# Altium schematic sheet IgnitionSchem2.SchDoc
size A4
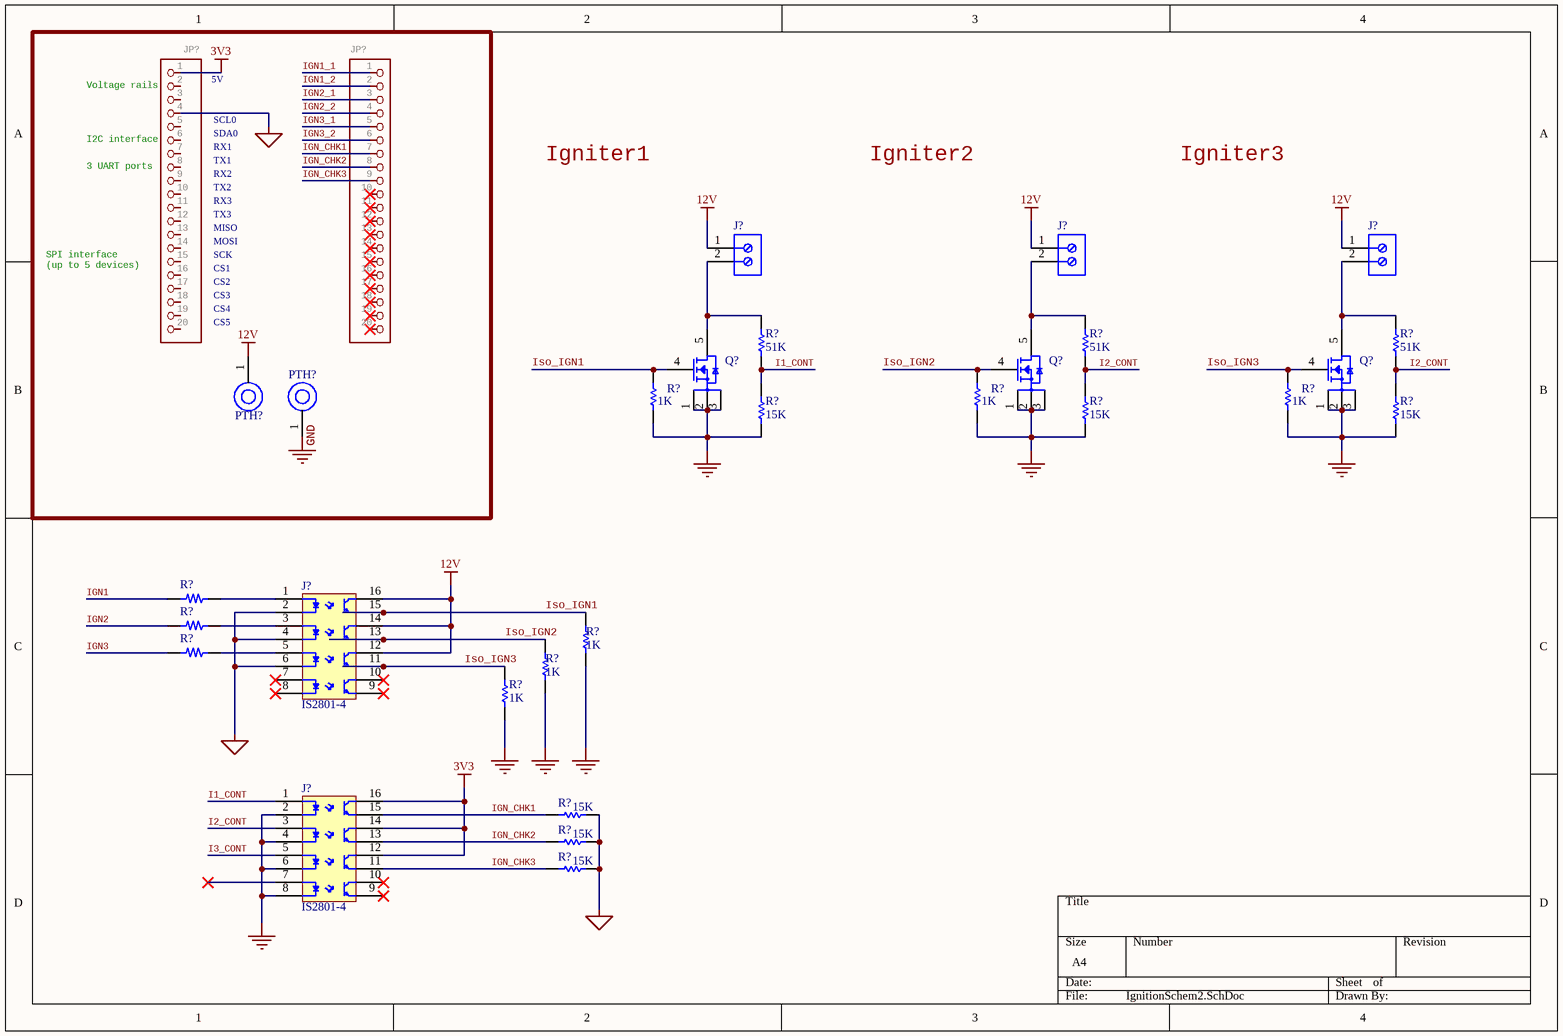
[diagram p0: IgnitionSchem2.SchDoc]

## Parts
(Parts that share a designator on the sheet are numbered #1, #2 ... from top to bottom, then left to right.)
J?#1  1725656  [PHOE-1725656-2]  (value not drawn)
J?#2  1725656  [PHOE-1725656-2]  (value not drawn)
J?#3  1725656  [PHOE-1725656-2]  (value not drawn)
J?#4  IS2801-4  [SOP127P680X220-16N]
J?#5  IS2801-4  [SOP127P680X220-16N]
JP?#1  PINHD-1X20  [1X20]  (value not drawn)
JP?#2  PINHD-1X20  [1X20]  (value not drawn)
PTH?#1  WIRE_CONNECTOR  [Wire Mount]  (value not drawn)
PTH?#2  WIRE_CONNECTOR  [Wire Mount]  (value not drawn)
Q?#1  Ingiter FET  [PSMN5R6-60YLX]  (value not drawn)
Q?#2  Ingiter FET  [PSMN5R6-60YLX]  (value not drawn)
Q?#3  Ingiter FET  [PSMN5R6-60YLX]  (value not drawn)
R?#1  51K  [RESC2013X60X35NL10T20]
R?#2  51K  [RESC2013X60X35NL10T20]
R?#3  51K  [RESC2013X60X35NL10T20]
R?#4  1K  [RESC2013X50X30NL20T20]
R?#5  1K  [RESC2013X50X30NL20T20]
R?#6  1K  [RESC2013X50X30NL20T20]
R?#7  15K  [RESC0805(2012)_M]
R?#8  15K  [RESC0805(2012)_M]
R?#9  15K  [RESC0805(2012)_M]
R?#10  WR06X331JTL  [WR06X331]  (value not drawn)
R?#11  WR06X331JTL  [WR06X331]  (value not drawn)
R?#12  WR06X331JTL  [WR06X331]  (value not drawn)
R?#13  1K  [RESC2013X50X30NL20T20]
R?#14  1K  [RESC2013X50X30NL20T20]
R?#15  1K  [RESC2013X50X30NL20T20]
R?#16  15K  [RESC0805(2012)_M]
R?#17  15K  [RESC0805(2012)_M]
R?#18  15K  [RESC0805(2012)_M]

## Nets
3V3: J?#5.12 J?#5.14 J?#5.16 JP?#1.1
12V: J?#1.1 J?#2.1 J?#3.1 J?#4.12 J?#4.14 J?#4.16 PTH?#1.1
GND: J?#5.2 J?#5.4 J?#5.6 J?#5.8 PTH?#2.1 Q?#1.1 Q?#1.2 Q?#1.3 Q?#2.1 Q?#2.2 Q?#2.3 Q?#3.1 Q?#3.2 Q?#3.3 R?#4.1 R?#5.1 R?#6.1 R?#7.1 R?#8.1 R?#9.1 R?#13.1 R?#14.1 R?#15.1
MCU_GND: J?#4.2 J?#4.4 J?#4.6 JP?#1.4 R?#16.2 R?#17.2 R?#18.2
I1_CONT: J?#5.1 R?#1.1 R?#7.2
I2_CONT: J?#5.3 R?#2.1 R?#3.1 R?#8.2 R?#9.2
I3_CONT: J?#5.5
IGN1: R?#10.1
IGN1_1: JP?#2.1
IGN1_2: JP?#2.2
IGN2: R?#11.1
IGN2_1: JP?#2.3
IGN2_2: JP?#2.4
IGN3: R?#12.1
IGN3_1: JP?#2.5
IGN3_2: JP?#2.6
IGN_CHK1: J?#5.15 JP?#2.7 R?#16.1
IGN_CHK2: J?#5.13 JP?#2.8 R?#17.1
IGN_CHK3: J?#5.11 JP?#2.9 R?#18.1
Iso_IGN1: J?#4.15 Q?#1.4 R?#4.2 R?#13.2
Iso_IGN2: J?#4.13 Q?#2.4 R?#5.2 R?#14.2
Iso_IGN3: J?#4.11 Q?#3.4 R?#6.2 R?#15.2
NetJ?#1_2: J?#1.2 Q?#1.5 R?#1.2
NetJ?#2_2: J?#2.2 Q?#2.5 R?#2.2
NetJ?#3_2: J?#3.2 Q?#3.5 R?#3.2
NetJ?#4_1: J?#4.1 R?#10.2
NetJ?#4_3: J?#4.3 R?#11.2
NetJ?#4_5: J?#4.5 R?#12.2

Not connected (* = marked no-connect by the designer): J?#4 7* 8* 9* 10*; J?#5 7* 9* 10*; JP?#1 2 3 5 6 7 8 9 10 11 12 13 14 15 16 17 18 19 20; JP?#2 10* 11* 12* 13* 14* 15* 16* 17* 18* 19* 20*

## Notes on the sheet
- (near JP?#1) Voltage rails
- (near JP?#1) 5V
- (near JP?#1) 3 UART ports
- (near JP?#1) I2C interface
- (near JP?#1) SCL0
- (near JP?#1) SDA0
- (near JP?#1) RX1
- (near JP?#1) TX1
- (near JP?#1) RX2
- Igniter1
- Igniter2
- Igniter3
- (near JP?#1) TX2
- (near JP?#1) RX3
- (near JP?#1) TX3
- (near JP?#1) MISO
- (near JP?#1) MOSI
- (near JP?#1) SPI interface
  (up to 5 devices)
- (near JP?#1) SCK
- (near JP?#1) CS1
- (near JP?#1) CS2
- (near JP?#1) CS3
- CS4
- CS5
- Labels drawn without touching a wire or pin: GND

## Library data of the parts
J?#1-J?#3 = CMP-2000-05299-1: Male Header, Pitch 2.54 mm, 1 x 2 Position, Height 9 mm, Tail Length 3.5 mm; Manufacturer: Phoenix Contact; Number of contacts: 2; Content: 250pc(s); Pitch: 2.54mm; Industrial packaging: Yes; Colour: Green; Manufacturer part No.: 1725656; Type: MPT0,5/2-2,54; Datasheet URL: http://datasheet.octopart.com/1725656-Phoenix-Contact-datasheet-5302866.pdf; Manufacturer URL: http://www.phoenixcontact.com/; Datasheet Version: Apr-08
J?#4 J?#5 = IS2801-4: Optocoupler DC-IN 4-CH Transistor DC-OUT 16-Pin T/R; Manufacturer: Isocom; Number of Channels: 4; Max Output Voltage: 80V; Output Current per Channel: 50mA; Forward Voltage: 1.2V; Collector Emitter Voltage (VCEO): 400mV; Supplier 1: Digi-Key; Supplier Part Number 1: IS2801-4CT-ND; Manufacturer Part Number: IS2801-4; RoHS: Yes; Category: Optocouplers; Stock 1: 23249; Pricing 1: 1=1.63000, 10=1.03000, 100=0.76220, 500=0.70040, 1000=0.57680 (USD); Mount: Surface Mount; Case/Package: SOIC; Number of Pins: 16; Min Operating Temperature: -55°C; Max Operating Temperature: 110°C; Packaging: Tape and Reel; Lead Free: Lead Free; RoHS Compliant: Yes; ComponentLink1URL: https://datasheet.ciiva.com/16495/is2801-4smt-r-16495642.pdf?src-supplier=Future+Electronics; ComponentLink1Description: https://datasheet.ciiva.com/16495/is2801-4smt-r-16495642.pdf?src-supplier=Future+Electronics; ComponentLink2URL: https://datasheet.ciiva.com/29301/156969-da-01-en-optokoppler-is-2801-4-29301144.pdf?src-supplier=Conrad; ComponentLink2Description: https://datasheet.ciiva.com/29301/156969-da-01-en-optokoppler-is-2801-4-29301144.pdf?src-supplier=Conrad
JP?#1 JP?#2 = PINHD-1X20: PIN HEADER; GateName_1: A; SymbolName_1: PINHD20; LibraryName: adafruit; DeviceSetName: PINHD-1X20
Q?#1-Q?#3 = PSMN5R6-60YLX: PSMN5R6-60YL - N-channel 60 V, 5.6 mO logic level MOSFET in LFPAK56; Manufacturer: Nexperia; Supplier 1: Mouser; Supplier Part Number 1: 771-PSMN5R6-60YLX; Manufacturer Part Number: PSMN5R6-60YLX; RoHS: Yes; Category: MOSFETs; Stock 1: 26943; Pricing 1: 1=1.17000, 10=1.05000, 50=1.05000, 100=0.82100, 1000=0.54200, 10000=0.45300 (USD); RoHS Compliant: Yes
R?#1-R?#3 = CMP-2001-01389-1: Manufacturer: Yageo; Part Number: RC0805JR-0751KL
R?#4-R?#6 R?#13-R?#15 = CMP-1013-00510-2: Part Number: CRCW08051K00FKEA; Manufacturer: Vishay Dale
R?#7-R?#9 R?#16-R?#18 = CMP-1013-00102-1: 15K 0.125W 5% 0805 (2012 Metric)  SMD; Case-EIA: 0805; Case-Metric: 2012; Value: 15000.00 Ohm; Power: 0.125 W; Technology: SMT; Tolerance: 5 %
R?#10-R?#12 = WR06X331JTL: Res Thick Film 0603 330 Ohm 5% 0.1W(1/10W) ±100ppm/C SMD T/R; Manufacturer: Walsin Technologies; Resistance: 330R; Temperature Coefficient: 100ppm/°C; Power Rating: 100mW; Voltage Rating (DC): 75V; Supplier 1: Digi-Key; Supplier Part Number 1: 1292-WR06X331JTLCT-ND; Manufacturer Part Number: WR06X331JTL; RoHS: Yes; Category: Uncategorized; Stock 1: 116752; Pricing 1: 1=0.10000, 10=0.01000, 100=0.00330, 1000=0.00147, 2500=0.00128 (USD); Case/Package: 0603; Contact Material: Tin; Min Operating Temperature: -55°C; Max Operating Temperature: 155°C; Tolerance: 5%; Packaging: Tape and Reel; Working Voltage: 75V; Number of Terminations: 2; Lead Free: Lead Free; RoHS Compliant: Yes; ComponentLink1URL: http://www.farnell.com/datasheets/1960319.pdf?src-supplier=Farnell; ComponentLink1Description: http://www.farnell.com/datasheets/1960319.pdf?src-supplier=Farnell